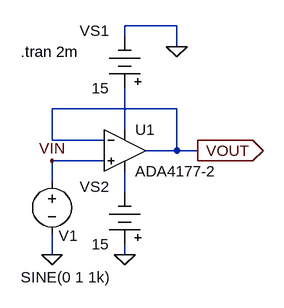
[diagram p0: schematic fig-01-02-07.asc]
fig-01-02-07.asc, the LTspice schematic file:
Version 4
SHEET 1 880 680
WIRE 288 -16 208 -16
WIRE 208 0 208 -16
WIRE 288 16 288 -16
WIRE 288 112 96 112
WIRE 208 144 208 80
WIRE 96 160 96 112
WIRE 176 160 96 160
WIRE 288 176 288 112
WIRE 288 176 240 176
WIRE 320 176 288 176
WIRE 176 192 96 192
WIRE 96 224 96 192
WIRE 208 240 208 208
WIRE 96 336 96 304
WIRE 208 336 208 320
FLAG 288 16 0
FLAG 208 336 0
FLAG 96 336 0
FLAG 320 176 VOUT
IOPIN 320 176 Out
FLAG 96 192 VIN
SYMBOL Misc\\battery 208 96 R180
WINDOW 0 24 104 Left 2
WINDOW 3 24 16 Left 2
SYMATTR InstName VS1
SYMATTR Value 15
SYMBOL Misc\\battery 208 336 R180
WINDOW 0 24 104 Left 2
WINDOW 3 24 16 Left 2
SYMATTR InstName VS2
SYMATTR Value 15
SYMBOL voltage 96 208 R0
WINDOW 0 10 99 Left 2
WINDOW 3 -48 163 Left 2
WINDOW 123 0 0 Left 0
WINDOW 39 0 0 Left 0
SYMATTR InstName V1
SYMATTR Value SINE(0 1 1k)
SYMBOL Opamps\\ADA4177-2 208 176 R0
SYMATTR InstName U1
TEXT 48 24 Left 2 !.tran 2m

The netlist it stands for:
* fig-01-02-07.asc
VS1 N001 0 15
VS2 0 N002 15
V1 VIN 0 SINE(0 1 1k)
* U1: ADA4177-2 (symbol Opamps\ADA4177-2 not available, pins judged from their places): In+=VIN In-=VOUT V+=N001 V-=N002 OUT=VOUT
.tran 2m
.backanno
.end